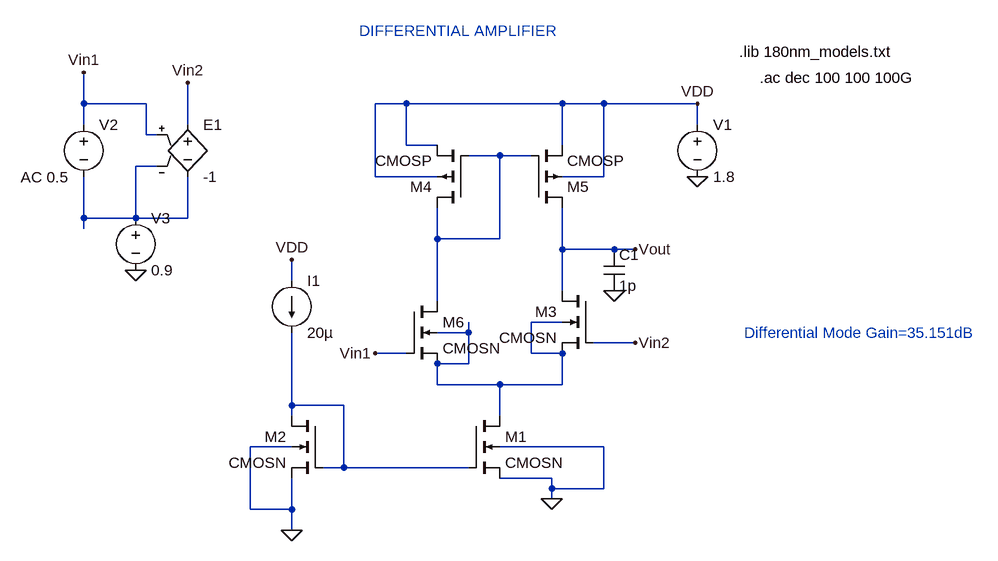
[diagram p0: schematic final_aic.asc]
final_aic.asc, the LTspice schematic file:
Version 4
SHEET 1 1120 680
WIRE -288 -48 -288 -96
WIRE -192 -48 -288 -48
WIRE 208 -48 160 -48
WIRE 448 -48 208 -48
WIRE 512 -48 448 -48
WIRE 656 -48 512 -48
WIRE -288 -16 -288 -48
WIRE -128 -16 -128 -80
WIRE 656 -16 656 -48
WIRE -192 0 -192 -48
WIRE -176 0 -192 0
WIRE 208 16 208 -48
WIRE 256 16 208 16
WIRE 448 16 448 -48
WIRE 352 32 304 32
WIRE 400 32 352 32
WIRE -176 48 -208 48
WIRE 160 64 160 -48
WIRE 256 64 160 64
WIRE 512 64 512 -48
WIRE 512 64 448 64
WIRE -288 128 -288 64
WIRE -208 128 -208 48
WIRE -208 128 -288 128
WIRE -128 128 -128 64
WIRE -128 128 -208 128
WIRE -288 144 -288 128
WIRE 256 160 256 112
WIRE 352 160 352 32
WIRE 352 160 256 160
WIRE 448 176 448 112
WIRE 528 176 448 176
WIRE 560 176 528 176
WIRE 32 224 32 192
WIRE 448 240 448 176
WIRE 256 256 256 160
WIRE 448 288 400 288
WIRE 304 304 304 288
WIRE 304 304 256 304
WIRE 560 320 496 320
WIRE 208 336 160 336
WIRE 400 336 400 288
WIRE 448 336 400 336
WIRE 256 352 256 336
WIRE 304 352 304 304
WIRE 304 352 256 352
WIRE 256 384 256 352
WIRE 352 384 256 384
WIRE 448 384 448 336
WIRE 448 384 352 384
WIRE 32 416 32 304
WIRE 112 416 32 416
WIRE 32 432 32 416
WIRE 352 432 352 384
WIRE 32 480 -32 480
WIRE 512 480 352 480
WIRE 112 512 112 416
WIRE 112 512 80 512
WIRE 304 512 112 512
WIRE 432 528 352 528
WIRE 432 544 432 528
WIRE 512 544 512 480
WIRE 512 544 432 544
WIRE 432 560 432 544
WIRE -32 576 -32 480
WIRE 32 576 32 528
WIRE 32 576 -32 576
WIRE 32 608 32 576
FLAG -208 208 0
FLAG 560 320 Vin2
FLAG -128 -80 Vin2
FLAG -288 -96 Vin1
FLAG 656 64 0
FLAG 560 176 Vout
FLAG 160 336 Vin1
FLAG 32 608 0
FLAG 432 560 0
FLAG 656 -48 VDD
FLAG 32 192 VDD
FLAG 528 240 0
SYMBOL voltage 656 -32 R0
WINDOW 123 0 0 Left 0
WINDOW 39 0 0 Left 0
SYMATTR InstName V1
SYMATTR Value 1.8
SYMBOL voltage -288 -32 R0
WINDOW 123 -97 97 Left 2
WINDOW 39 0 0 Left 0
SYMATTR Value2 AC 0.5
SYMATTR InstName V2
SYMATTR Value ""
SYMBOL voltage -208 112 R0
WINDOW 123 0 0 Left 0
WINDOW 39 0 0 Left 0
SYMATTR InstName V3
SYMATTR Value 0.9
SYMBOL current 32 224 R0
WINDOW 123 0 0 Left 0
WINDOW 39 0 0 Left 0
SYMATTR InstName I1
SYMATTR Value 20µ
SYMBOL e -128 -32 R0
SYMATTR InstName E1
SYMATTR Value -1
SYMBOL cmosn 304 432 R0
SYMATTR InstName M1
SYMATTR Value2 l=0.5u w=2u m=2
SYMBOL cmosn 80 432 M0
SYMATTR InstName M2
SYMATTR Value2 l=0.5u w=1u m=1
SYMBOL cmosn 496 240 M0
SYMATTR InstName M3
SYMATTR Value2 l=0.5u w=2u m=2
SYMBOL cmosp 304 112 R180
SYMATTR InstName M4
SYMATTR Value2 l=0.5u w=2u m=2
SYMBOL cmosp 400 112 M180
SYMATTR InstName M5
SYMATTR Value2 l=0.5u w=2u m=2
SYMBOL cmosn 208 256 R0
SYMATTR InstName M6
SYMATTR Value2 l=0.5u w=2u m=2
SYMBOL cap 512 176 R0
SYMATTR InstName C1
SYMATTR Value 1p
TEXT 752 -88 Left 2 !.ac dec 100 100 100G
TEXT 720 -128 Left 2 !.lib 180nm_models.txt
TEXT 136 -160 Left 2 ;DIFFERENTIAL AMPLIFIER
TEXT 728 304 Left 2 ;Differential Mode Gain=35.151dB

The netlist it stands for:
* final_aic.asc
V1 VDD 0 1.8
V2 Vin1 N002 AC 0.5
V3 N002 0 0.9
I1 VDD N004 20µ
E1 Vin2 N002 Vin1 N002 -1
M1 N003 N004 0 0 CMOSN l=0.5u w=2u m=2
M2 N004 N004 0 0 CMOSN l=0.5u w=1u m=1
M3 Vout Vin2 N003 N003 CMOSN l=0.5u w=2u m=2
M4 N001 N001 VDD VDD CMOSP l=0.5u w=2u m=2
M5 Vout N001 VDD VDD CMOSP l=0.5u w=2u m=2
M6 N001 Vin1 N003 N003 CMOSN l=0.5u w=2u m=2
C1 Vout 0 1p
.model NMOS NMOS
.model PMOS PMOS
.lib standard.mos
.ac dec 100 100 100G
.lib 180nm_models.txt
* DIFFERENTIAL AMPLIFIER
* Differential Mode Gain=35.151dB
.backanno
.end